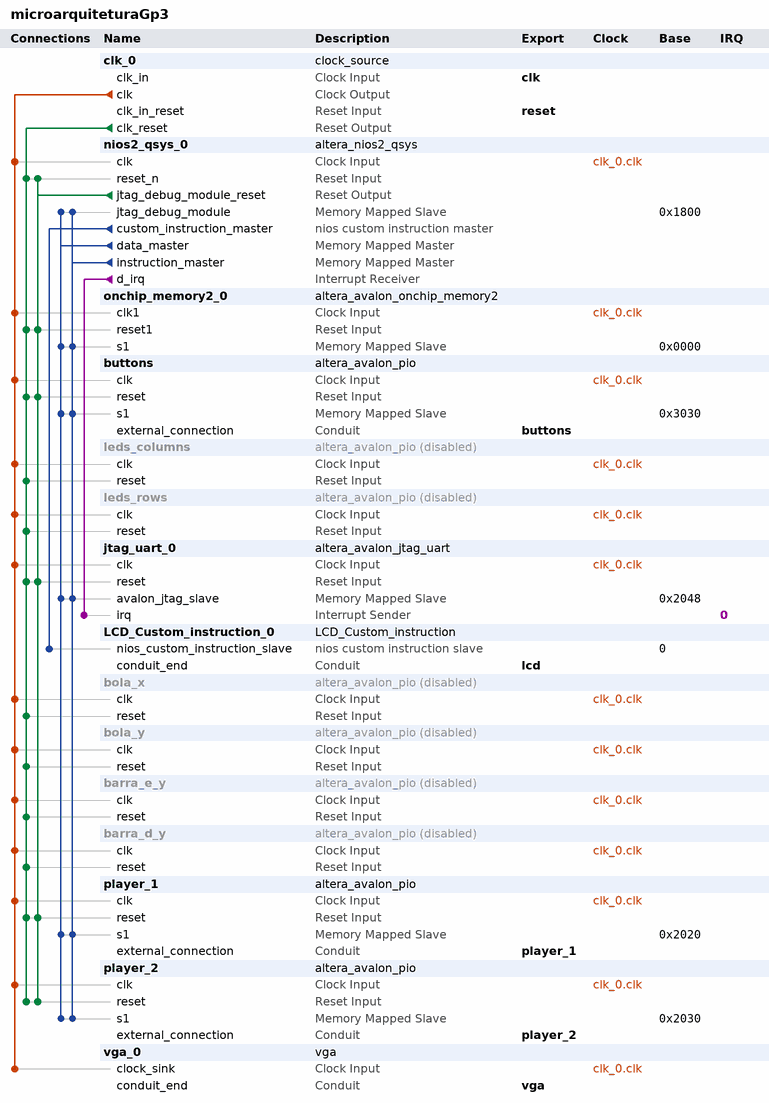
[diagram p0: system contents]
# Platform Designer (Qsys) system microarquiteturaGp3, Cyclone IV E EP4CE30F23C7
# Parameters at their usual value, and those the tool derives, are not listed.
package require -exact qsys 13.0.1.99.2
create_system microarquiteturaGp3
set_project_property DEVICE_FAMILY {Cyclone IV E}
set_project_property DEVICE EP4CE30F23C7

add_instance clk_0 clock_source 13.0
set_instance_parameter_value clk_0 clockFrequency 50000000

add_instance nios2_qsys_0 altera_nios2_qsys 13.0
set_instance_parameter_value nios2_qsys_0 resetSlave onchip_memory2_0.s1
set_instance_parameter_value nios2_qsys_0 mmu_TLBMissExcSlave None
set_instance_parameter_value nios2_qsys_0 exceptionSlave onchip_memory2_0.s1
set_instance_parameter_value nios2_qsys_0 breakSlave nios2_qsys_0.jtag_debug_module
set_instance_parameter_value nios2_qsys_0 impl Tiny
set_instance_parameter_value nios2_qsys_0 icache_size 4096

add_instance onchip_memory2_0 altera_avalon_onchip_memory2 13.0.1.99.2
set_instance_parameter_value onchip_memory2_0 dataWidth 32
set_instance_parameter_value onchip_memory2_0 dualPort false
set_instance_parameter_value onchip_memory2_0 initMemContent true
set_instance_parameter_value onchip_memory2_0 initializationFileName onchip_mem.hex
set_instance_parameter_value onchip_memory2_0 memorySize 4096

add_instance buttons altera_avalon_pio 13.0.1.99.2
set_instance_parameter_value buttons direction Input
set_instance_parameter_value buttons width 1

add_instance leds_columns altera_avalon_pio 13.0.1.99.2
set_instance_property leds_columns ENABLED false
set_instance_parameter_value leds_columns direction Output
set_instance_parameter_value leds_columns width 5

add_instance leds_rows altera_avalon_pio 13.0.1.99.2
set_instance_property leds_rows ENABLED false
set_instance_parameter_value leds_rows direction Output
set_instance_parameter_value leds_rows width 8

add_instance jtag_uart_0 altera_avalon_jtag_uart 13.0.1.99.2
set_instance_parameter_value jtag_uart_0 simInteractiveOptions NO_INTERACTIVE_WINDOWS

add_instance LCD_Custom_instruction_0 LCD_Custom_instruction 1.0
set_instance_parameter_value LCD_Custom_instruction_0 idle_state 0
set_instance_parameter_value LCD_Custom_instruction_0 busy_state 1
set_instance_parameter_value LCD_Custom_instruction_0 end_state 3

add_instance bola_x altera_avalon_pio 13.0.1.99.2
set_instance_property bola_x ENABLED false
set_instance_parameter_value bola_x direction Output
set_instance_parameter_value bola_x width 10

add_instance bola_y altera_avalon_pio 13.0.1.99.2
set_instance_property bola_y ENABLED false
set_instance_parameter_value bola_y direction Output
set_instance_parameter_value bola_y width 10

add_instance barra_e_y altera_avalon_pio 13.0.1.99.2
set_instance_property barra_e_y ENABLED false
set_instance_parameter_value barra_e_y direction Output
set_instance_parameter_value barra_e_y width 10

add_instance barra_d_y altera_avalon_pio 13.0.1.99.2
set_instance_property barra_d_y ENABLED false
set_instance_parameter_value barra_d_y direction Output
set_instance_parameter_value barra_d_y width 10

add_instance player_1 altera_avalon_pio 13.0.1.99.2
set_instance_parameter_value player_1 direction Input
set_instance_parameter_value player_1 width 3

add_instance player_2 altera_avalon_pio 13.0.1.99.2
set_instance_parameter_value player_2 direction Input
set_instance_parameter_value player_2 width 3

add_instance vga_0 vga 1.0

# connections
add_connection clk_0.clk barra_d_y.clk clock
add_connection clk_0.clk barra_e_y.clk clock
add_connection clk_0.clk bola_x.clk clock
add_connection clk_0.clk bola_y.clk clock
add_connection clk_0.clk buttons.clk clock
add_connection clk_0.clk jtag_uart_0.clk clock
add_connection clk_0.clk leds_columns.clk clock
add_connection clk_0.clk leds_rows.clk clock
add_connection clk_0.clk nios2_qsys_0.clk clock
add_connection clk_0.clk onchip_memory2_0.clk1 clock
add_connection clk_0.clk player_1.clk clock
add_connection clk_0.clk player_2.clk clock
add_connection clk_0.clk vga_0.clock_sink clock
add_connection clk_0.clk_reset barra_d_y.reset reset
add_connection clk_0.clk_reset barra_e_y.reset reset
add_connection clk_0.clk_reset bola_x.reset reset
add_connection clk_0.clk_reset bola_y.reset reset
add_connection clk_0.clk_reset buttons.reset reset
add_connection clk_0.clk_reset jtag_uart_0.reset reset
add_connection clk_0.clk_reset leds_columns.reset reset
add_connection clk_0.clk_reset leds_rows.reset reset
add_connection clk_0.clk_reset nios2_qsys_0.reset_n reset
add_connection clk_0.clk_reset onchip_memory2_0.reset1 reset
add_connection clk_0.clk_reset player_1.reset reset
add_connection clk_0.clk_reset player_2.reset reset
add_connection nios2_qsys_0.jtag_debug_module_reset buttons.reset reset
add_connection nios2_qsys_0.jtag_debug_module_reset jtag_uart_0.reset reset
add_connection nios2_qsys_0.jtag_debug_module_reset nios2_qsys_0.reset_n reset
add_connection nios2_qsys_0.jtag_debug_module_reset onchip_memory2_0.reset1 reset
add_connection nios2_qsys_0.jtag_debug_module_reset player_1.reset reset
add_connection nios2_qsys_0.jtag_debug_module_reset player_2.reset reset
add_connection nios2_qsys_0.data_master buttons.s1 avalon
set_connection_parameter_value nios2_qsys_0.data_master/buttons.s1 baseAddress 0x3030
add_connection nios2_qsys_0.data_master jtag_uart_0.avalon_jtag_slave avalon
set_connection_parameter_value nios2_qsys_0.data_master/jtag_uart_0.avalon_jtag_slave baseAddress 0x2048
add_connection nios2_qsys_0.data_master nios2_qsys_0.jtag_debug_module avalon
set_connection_parameter_value nios2_qsys_0.data_master/nios2_qsys_0.jtag_debug_module baseAddress 0x1800
add_connection nios2_qsys_0.data_master onchip_memory2_0.s1 avalon
set_connection_parameter_value nios2_qsys_0.data_master/onchip_memory2_0.s1 baseAddress 0x0000
add_connection nios2_qsys_0.data_master player_1.s1 avalon
set_connection_parameter_value nios2_qsys_0.data_master/player_1.s1 baseAddress 0x2020
add_connection nios2_qsys_0.data_master player_2.s1 avalon
set_connection_parameter_value nios2_qsys_0.data_master/player_2.s1 baseAddress 0x2030
add_connection nios2_qsys_0.instruction_master buttons.s1 avalon
set_connection_parameter_value nios2_qsys_0.instruction_master/buttons.s1 baseAddress 0x3030
add_connection nios2_qsys_0.instruction_master jtag_uart_0.avalon_jtag_slave avalon
set_connection_parameter_value nios2_qsys_0.instruction_master/jtag_uart_0.avalon_jtag_slave baseAddress 0x2048
add_connection nios2_qsys_0.instruction_master nios2_qsys_0.jtag_debug_module avalon
set_connection_parameter_value nios2_qsys_0.instruction_master/nios2_qsys_0.jtag_debug_module baseAddress 0x1800
add_connection nios2_qsys_0.instruction_master onchip_memory2_0.s1 avalon
set_connection_parameter_value nios2_qsys_0.instruction_master/onchip_memory2_0.s1 baseAddress 0x0000
add_connection nios2_qsys_0.instruction_master player_1.s1 avalon
set_connection_parameter_value nios2_qsys_0.instruction_master/player_1.s1 baseAddress 0x2020
add_connection nios2_qsys_0.instruction_master player_2.s1 avalon
set_connection_parameter_value nios2_qsys_0.instruction_master/player_2.s1 baseAddress 0x2030
add_connection nios2_qsys_0.d_irq jtag_uart_0.irq interrupt
set_connection_parameter_value nios2_qsys_0.d_irq/jtag_uart_0.irq irqNumber 0
add_connection nios2_qsys_0.custom_instruction_master LCD_Custom_instruction_0.nios_custom_instruction_slave nios_custom_instruction
set_connection_parameter_value nios2_qsys_0.custom_instruction_master/LCD_Custom_instruction_0.nios_custom_instruction_slave CIName lcd_custom_instruction_0
set_connection_parameter_value nios2_qsys_0.custom_instruction_master/LCD_Custom_instruction_0.nios_custom_instruction_slave baseAddress 0

# exported interfaces
add_interface buttons conduit end
set_interface_property buttons EXPORT_OF buttons.external_connection
add_interface clk clock sink
set_interface_property clk EXPORT_OF clk_0.clk_in
add_interface lcd conduit end
set_interface_property lcd EXPORT_OF LCD_Custom_instruction_0.conduit_end
add_interface player_1 conduit end
set_interface_property player_1 EXPORT_OF player_1.external_connection
add_interface player_2 conduit end
set_interface_property player_2 EXPORT_OF player_2.external_connection
add_interface reset reset sink
set_interface_property reset EXPORT_OF clk_0.clk_in_reset
add_interface vga conduit end
set_interface_property vga EXPORT_OF vga_0.conduit_end

set_interconnect_requirement {$system} qsys_mm.clockCrossingAdapter HANDSHAKE
set_interconnect_requirement {$system} qsys_mm.maxAdditionalLatency 1

save_system microarquiteturaGp3.qsys
